# Altium schematic sheet SPI_MUX.SchDoc: Title
size 420 x 297 mm; Author: G.Kasprowicz; CompanyName: WUT ISE; DrawnBy: G.Kasprowicz; Organization: WUT ISE; Address1: PW ISE; Address2: Nowowiejska 15/19 00-665 Warsaw; Address3: gkasprow@gmail.com; Revision: 2; SheetNumber: -; SheetTotal: -; ModifiedBy: -; CheckedDate: -; Title2: Title 2; DivGrp: WUT ISE; Designer: G.Kasprowicz; ModifiedDate: -; ProjectName: Sensor Box
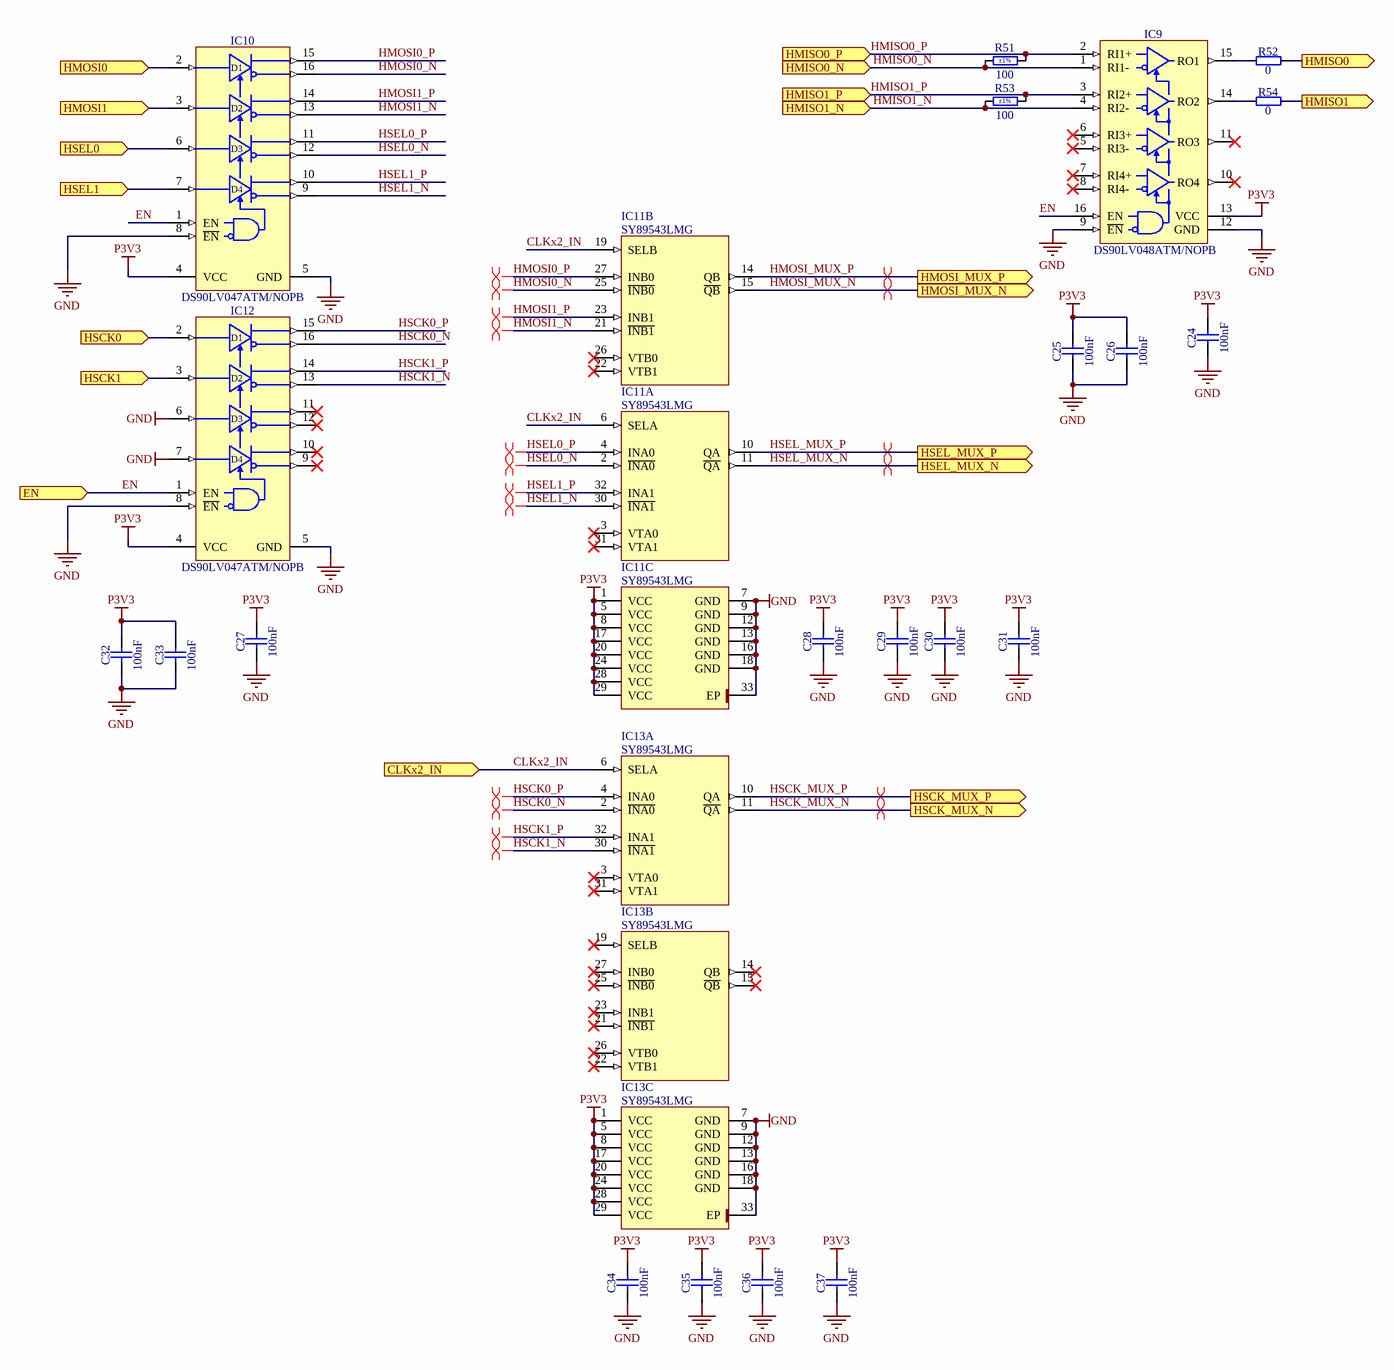
[diagram p0: SPI_MUX.SchDoc]

## Parts
C24  100nF  [CAPC1005X55N]
C25  100nF  [CAPC1005X55N]
C26  100nF  [CAPC1005X55N]
C27  100nF  [CAPC1005X55N]
C28  100nF  [CAPC1005X55N]
C29  100nF  [CAPC1005X55N]
C30  100nF  [CAPC1005X55N]
C31  100nF  [CAPC1005X55N]
C32  100nF  [CAPC1005X55N]
C33  100nF  [CAPC1005X55N]
C34  100nF  [CAPC1005X55N]
C35  100nF  [CAPC1005X55N]
C36  100nF  [CAPC1005X55N]
C37  100nF  [CAPC1005X55N]
IC9  DS90LV048ATM/NOPB  [SOIC127P600X175-16N]
IC10  DS90LV047ATM/NOPB  [SOIC127P600X175-16N]
IC11  SY89543LMG  [QFN50P500X500X90-33N-S320]  (parts A,B,C of 3)
IC12  DS90LV047ATM/NOPB  [SOIC127P600X175-16N]
IC13  SY89543LMG  [QFN50P500X500X90-33N-S320]  (parts A,B,C of 3)
R51  100  Tolerance: ±1%  [RESC1005X40N]
R52  0  [RESC1005X40N]
R53  100  Tolerance: ±1%  [RESC1005X40N]
R54  0  [RESC1005X40N]

## Ports
CLKx2_IN (in), EN (in), HMISO0 (out), HMISO0_N (in), HMISO0_P (in), HMISO1 (out), HMISO1_N (in), HMISO1_P (in), HMOSI0 (in), HMOSI1 (in), HMOSI_MUX_N (out), HMOSI_MUX_P (out), HSCK0 (in), HSCK1 (in), HSCK_MUX_N (out), HSCK_MUX_P (out), HSEL0 (in), HSEL1 (in), HSEL_MUX_N (out), HSEL_MUX_P (out)

## Nets
GND: C24.1 C25.1 C26.1 C27.1 C28.1 C29.1 C30.1 C31.1 C32.1 C33.1 C34.1 C35.1 C36.1 C37.1 IC9.9(~{EN}) IC9.12(GND) IC10.5(GND) IC10.8(~{EN}) IC11.7(GND) IC11.9(GND) IC11.12(GND) IC11.13(GND) IC11.16(GND) IC11.18(GND) IC11.33(EP) IC12.5(GND) IC12.6(DIN3) IC12.7(DIN4) IC12.8(~{EN}) IC13.7(GND) IC13.9(GND) IC13.12(GND) IC13.13(GND) IC13.16(GND) IC13.18(GND) IC13.33(EP)
P3V3: C24.2 C25.2 C26.2 C27.2 C28.2 C29.2 C30.2 C31.2 C32.2 C33.2 C34.2 C35.2 C36.2 C37.2 IC9.13(VCC) IC10.4(VCC) IC11.1(VCC) IC11.5(VCC) IC11.8(VCC) IC11.17(VCC) IC11.20(VCC) IC11.24(VCC) IC11.28(VCC) IC11.29(VCC) IC12.4(VCC) IC13.1(VCC) IC13.5(VCC) IC13.8(VCC) IC13.17(VCC) IC13.20(VCC) IC13.24(VCC) IC13.28(VCC) IC13.29(VCC)
CLKx2_IN: IC11.6(SELA) IC11.19(SELB) IC13.6(SELA) ; port CLKx2_IN
EN: IC9.16(EN) IC10.1(EN) IC12.1(EN) ; port EN
HMISO0: R52.2 ; port HMISO0
HMISO0_N: IC9.1(RI1-) R51.1 ; port HMISO0_N
HMISO0_P: IC9.2(RI1+) R51.2 ; port HMISO0_P
HMISO1: R54.2 ; port HMISO1
HMISO1_N: IC9.4(RI2-) R53.1 ; port HMISO1_N
HMISO1_P: IC9.3(RI2+) R53.2 ; port HMISO1_P
HMOSI0: IC10.2(DIN1) ; port HMOSI0
HMOSI0_N: IC10.16(DOUT1-) IC11.25(~{INB0})
HMOSI0_P: IC10.15(DOUT1+) IC11.27(INB0)
HMOSI1: IC10.3(DIN2) ; port HMOSI1
HMOSI1_N: IC10.13(DOUT2-) IC11.21(~{INB1})
HMOSI1_P: IC10.14(DOUT2+) IC11.23(INB1)
HMOSI_MUX_N: IC11.15(~{QB}) ; port HMOSI_MUX_N
HMOSI_MUX_P: IC11.14(QB) ; port HMOSI_MUX_P
HSCK0: IC12.2(DIN1) ; port HSCK0
HSCK0_N: IC12.16(DOUT1-) IC13.2(~{INA0})
HSCK0_P: IC12.15(DOUT1+) IC13.4(INA0)
HSCK1: IC12.3(DIN2) ; port HSCK1
HSCK1_N: IC12.13(DOUT2-) IC13.30(~{INA1})
HSCK1_P: IC12.14(DOUT2+) IC13.32(INA1)
HSCK_MUX_N: IC13.11(~{QA}) ; port HSCK_MUX_N
HSCK_MUX_P: IC13.10(QA) ; port HSCK_MUX_P
HSEL0: IC10.6(DIN3) ; port HSEL0
HSEL0_N: IC10.12(DOUT3-) IC11.2(~{INA0})
HSEL0_P: IC10.11(DOUT3+) IC11.4(INA0)
HSEL1: IC10.7(DIN4) ; port HSEL1
HSEL1_N: IC10.9(DOUT4-) IC11.30(~{INA1})
HSEL1_P: IC10.10(DOUT4+) IC11.32(INA1)
HSEL_MUX_N: IC11.11(~{QA}) ; port HSEL_MUX_N
HSEL_MUX_P: IC11.10(QA) ; port HSEL_MUX_P
NetIC9_14: IC9.14(RO2) R54.1
NetIC9_15: IC9.15(RO1) R52.1

Not connected (* = marked no-connect by the designer): IC9 5(RI3-)* 6(RI3+)* 7(RI4+)* 8(RI4-)* 10(RO4)* 11(RO3)*; IC11 3(VTA0)* 22(VTB1)* 26(VTB0)* 31(VTA1)*; IC12 9(DOUT4-)* 10(DOUT4+)* 11(DOUT3+)* 12(DOUT3-)*; IC13 3(VTA0)* 14(QB)* 15(~{QB})* 19(SELB)* 21(~{INB1})* 22(VTB1)* 23(INB1)* 25(~{INB0})* 26(VTB0)* 27(INB0)* 31(VTA1)*

## Layout directives
differential pair: HMOSI0_N, HMOSI0_P, HMOSI1_N, HMOSI1_P, HMOSI_MUX_N, HMOSI_MUX_P, HSCK0_N, HSCK0_P, HSCK1_N, HSCK1_P, HSCK_MUX_N, HSCK_MUX_P, HSEL0_N, HSEL0_P, HSEL1_N, HSEL1_P, HSEL_MUX_N, HSEL_MUX_P

## Notes on the sheet
- Project/Equipment
- Document
- Designer
- Drawn by
- Check.by
- Copyright WUT ISE 2024.
  This documentation describes Open Hardware and is licensed under the CERN OHL v.2. You may redistribute and modify this documentation under the terms of the CERN OHL v.2. (http://ohwr.org/CERNOHL). This documentation is distributed WITHOUT ANY EXPRESS OR IMPLIED WARRANTY, INCLUDING OF MERCHANTABILITY, SATISFACTORY QUALITY AND FITNESS FOR A PARTICULAR PURPOSE. Please see the CERN OHL v.2 for applicable conditions.
- Contact
- File
- Last Mod.
- Print Date
- Sheet
- Size
- A3
- of
- Rev
- (in symbol DS90LV047ATM/NOPB) D1; D2; D3; D4

## Library data of the parts
C24-C37 = CC0402_100NF_50V_10%_X7R: Non-polarised capacitor; Part Description: SMD Multilayer Chip Ceramic Capacitor; Manufacturer: GENERIC; Manufacturer1 Part Number: GRM155R71H104KE14D; Voltage: 50V; TC: X7R; Tolerance: ±10%; Part Number: CC0402_100NF_50V_10%_X7R; Component Kind: Standard; Component Type: Standard; Pin Count: 2; Value: 100nF; Status: None; Manufacturer Part Number: CC0402_100NF_50V_10%_X7R; Case: 0402; Mounted: Yes; Socket: No; SMD: Yes; Sense: No; Manufacturer1 Example: MURATA; Manufacturer1 ComponentHeight: 0.55mm; HelpURL: \\cern.ch\dfs\Applications\Altium\Datasheets\CC0402_MURATA_GRM155R71H104KE14D.pdf; Author: CERN DEM MR; CreateDate: 30.06.2017; LatestRevisionDate: 30.06.2017
IC9 = DS90LV048ATM/NOPB: 3V LVDS Quad CMOS Differential Line Receiver; Manufacturer: TEXAS INSTRUMENTS; PressFit: No; Bonding: No; Part Number: DS90LV048ATM/NOPB; Component Kind: Standard; Component Type: Standard; Device: DS90LV048ATM/NOPB; PackageDescription: SOIC 16, Pitch 1.27mm - Body 4x10mm, IPC Medium Density; Part Description: 3V LVDS Quad CMOS Differential Line Receiver; Manufacturer Part Number: DS90LV048ATM; Pin Count: 16; Case: SOIC16; Mounted: Yes; Socket: No; SMD: Yes; Sense: No; ComponentHeight: 1.75mm; Author: CERN DEM JLC; HelpURL: \\cern.ch\dfs\Applications\Altium\Datasheets\DS90LV048ATM-NOPB.pdf; CreateDate: 10.03.2014; LatestRevisionDate: 01.06.2022
IC10 IC12 = DS90LV047ATM/NOPB: 3V LVDS Quad CMOS Differential Line Driver; Manufacturer: TEXAS INSTRUMENTS; PressFit: No; Bonding: No; Part Number: DS90LV047ATM/NOPB; Component Kind: Standard; Component Type: Standard; Device: DS90LV047ATM/NOPB; PackageDescription: SOIC 16, Pitch 1.27mm - Body 4x10mm, IPC Medium Density; Part Description: 3V LVDS Quad CMOS Differential Line Driver; Manufacturer Part Number: DS90LV047ATM; Pin Count: 16; Case: SOIC16; Mounted: Yes; Socket: No; SMD: Yes; Sense: No; ComponentHeight: 1.75mm; Author: CERN DEM JLC; HelpURL: \\cern.ch\dfs\Applications\Altium\Datasheets\DS90LV047ATM-NOPB.pdf; CreateDate: 02.07.2014; LatestRevisionDate: 01.06.2022
IC11 IC13 = SY89543LMG: 3.3V, 3.2Gbps Dual, Differential 2:1 LVDS Multiplexer With Internal Termination; Manufacturer: MICREL; PressFit: No; Bonding: No; Part Number: SY89543LMG; Component Kind: Standard; Component Type: Standard; Device: SY89543LMG; PackageDescription: QFN, (MO-220-VHHD-4) 0.50mm Pitch, Square; 32 Pin, 5.00mm L X 5.00mm W X 0.9mm H body (w/Thermal Tab 3.20 X 3.20mm), IPC Medium Density; Part Description: 3.3V, 3.2Gbps Dual, Differential 2:1 LVDS Multiplexer with Internal Termination; Manufacturer Part Number: SY89543LMG; Pin Count: 33; Case: QFN32; Mounted: Yes; Socket: No; SMD: Yes; Sense: No; ComponentHeight: 0.9mm; Author: CERN DEM JLC; HelpURL: \\cern.ch\dfs\Applications\Altium\Datasheets\SY89543LMG.pdf; CreateDate: 05.12.2011; LatestRevisionDate: 21.12.2011
R51 R53 = R0402_100R_1%_0.0625W_100PPM: Resistor - 1%; Part Description: General Purpose Thick Film Chip Resistor; Manufacturer: GENERIC; Manufacturer1 Part Number: 232270671001L; TC: ±100ppm/°C; PressFit: No; Part Number: R0402_100R_1%_0.0625W_100PPM; Component Kind: Standard; Component Type: Standard; Pin Count: 2; Value: 100; Status: Not Recommended; Power: 0.0625W; Manufacturer Part Number: R0402_100R_1%_0.0625W_100PPM; Case: 0402; Mounted: Yes; Sense: No; Socket: No; SMD: Yes; Manufacturer1 Example: YAGEO PHYCOMP; Manufacturer1 ComponentHeight: 0.4mm; HelpURL: \\cern.ch\dfs\Applications\Altium\Datasheets\R0402_Phycomp_RC0402.pdf; Author: CERN DEM JLC; CreateDate: 03.12.2007; LatestRevisionDate: 17.10.2012
R52 R54 = R0402_0R_JUMPER: Resistor; Part Description: 1A (0.05R Max DC Resistance) Zero Ohm Jumper; Manufacturer: GENERIC; Manufacturer1 Part Number: 232270591001L; PressFit: No; Part Number: R0402_0R_JUMPER; Component Kind: Standard; Component Type: Standard; Pin Count: 2; Value: 0; Status: Not Recommended; Manufacturer Part Number: R0402_0R_JUMPER; Case: 0402; Mounted: Yes; Sense: No; Socket: No; SMD: Yes; Manufacturer1 Example: YAGEO PHYCOMP; Manufacturer1 ComponentHeight: 0.4mm; HelpURL: \\cern.ch\dfs\Applications\Altium\Datasheets\R0402_Phycomp_RC0402.pdf; Author: CERN DEM JLC; CreateDate: 03.12.2007; LatestRevisionDate: 17.10.2012